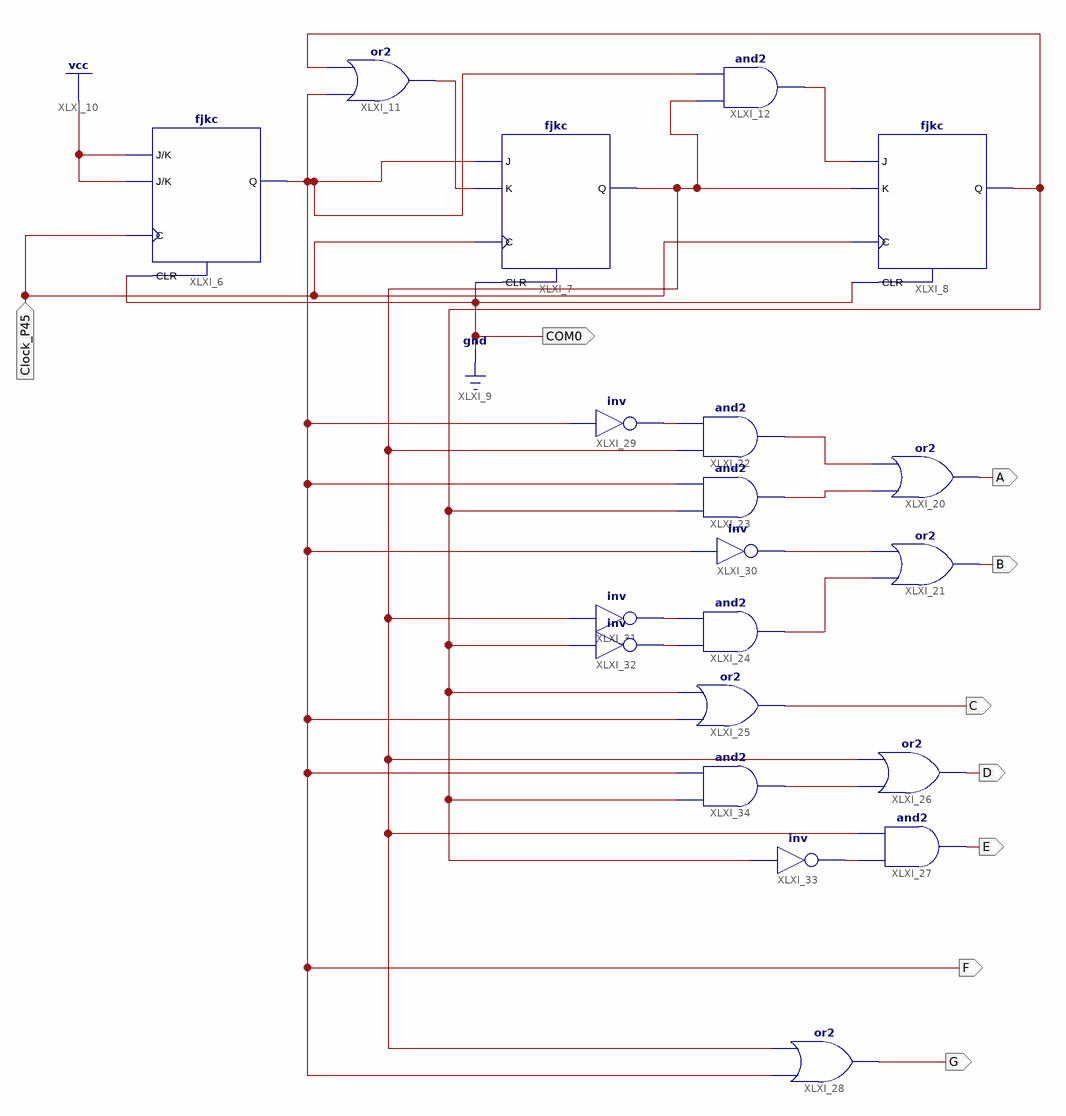
[diagram p0: schematic sheet 1]
// Xilinx ISE schematic no1.sch (spartan6) as structural Verilog: 20 symbols, 9 ports
module no1 (
  input  Clock_P45,
  output COM0,
  output F,
  output C,
  output G,
  output A,
  output B,
  output D,
  output E
);

  wire XLXN_7, XLXN_11, XLXN_23, XLXN_24, XLXN_25, XLXN_29, XLXN_30, XLXN_31, XLXN_32, XLXN_33, XLXN_37,
       XLXN_41, XLXN_50;

  fjkc XLXI_6 (.C(Clock_P45), .CLR(1'b0), .J(1'b1), .K(1'b1), .Q(F));
  fjkc XLXI_7 (.C(Clock_P45), .CLR(1'b0), .J(F), .K(XLXN_7), .Q(XLXN_41));
  fjkc XLXI_8 (.C(Clock_P45), .CLR(1'b0), .J(XLXN_11), .K(XLXN_41), .Q(XLXN_50));
  or XLXI_11 (XLXN_7, F, XLXN_50);
  and XLXI_12 (XLXN_11, XLXN_41, F);
  or XLXI_20 (A, XLXN_23, XLXN_24);
  or XLXI_21 (B, XLXN_25, XLXN_37);
  and XLXI_22 (XLXN_24, XLXN_41, XLXN_29);
  and XLXI_23 (XLXN_23, XLXN_50, F);
  and XLXI_24 (XLXN_25, XLXN_31, XLXN_30);
  or XLXI_25 (C, F, XLXN_50);
  or XLXI_26 (D, XLXN_33, XLXN_41);
  and XLXI_27 (E, XLXN_32, XLXN_41);
  or XLXI_28 (G, F, XLXN_41);
  not XLXI_29 (XLXN_29, F);
  not XLXI_30 (XLXN_37, F);
  not XLXI_31 (XLXN_30, XLXN_41);
  not XLXI_32 (XLXN_31, XLXN_50);
  not XLXI_33 (XLXN_32, XLXN_50);
  and XLXI_34 (XLXN_33, XLXN_50, F);

  assign COM0 = 1'b0;
endmodule
